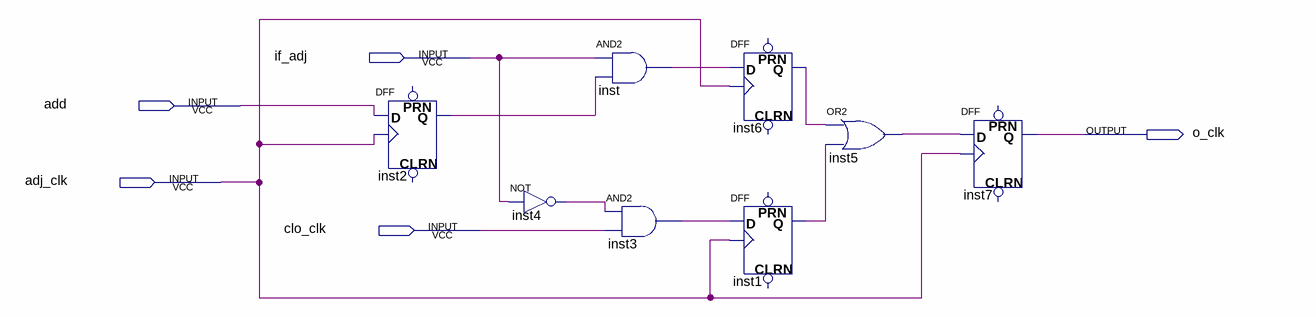
[diagram p0: schematic sheet]
// Quartus schematic adj_time.bdf as structural Verilog: 8 symbols, 5 pins
module adj_time (
  input  if_adj,
  input  add,
  input  adj_clk,
  input  clo_clk,
  output o_clk
);

  wire inst1_q, inst2_q, inst3_out, inst4_out, inst5_out, inst6_q, inst_out;

  DFF inst2 (.CLK(adj_clk), .D(add), .Q(inst2_q));  // open: CLRN, PRN
  not inst4 (inst4_out, if_adj);
  and inst (inst_out, if_adj, inst2_q);
  and inst3 (inst3_out, inst4_out, clo_clk);
  DFF inst6 (.CLK(adj_clk), .D(inst_out), .Q(inst6_q));  // open: CLRN, PRN
  DFF inst1 (.CLK(adj_clk), .D(inst3_out), .Q(inst1_q));  // open: CLRN, PRN
  or inst5 (inst5_out, inst6_q, inst1_q);
  DFF inst7 (.CLK(adj_clk), .D(inst5_out), .Q(o_clk));  // open: CLRN, PRN
endmodule
